# Altium schematic sheet Buck.SchDoc
size A4; SheetNumber: 2; SheetTotal: 6
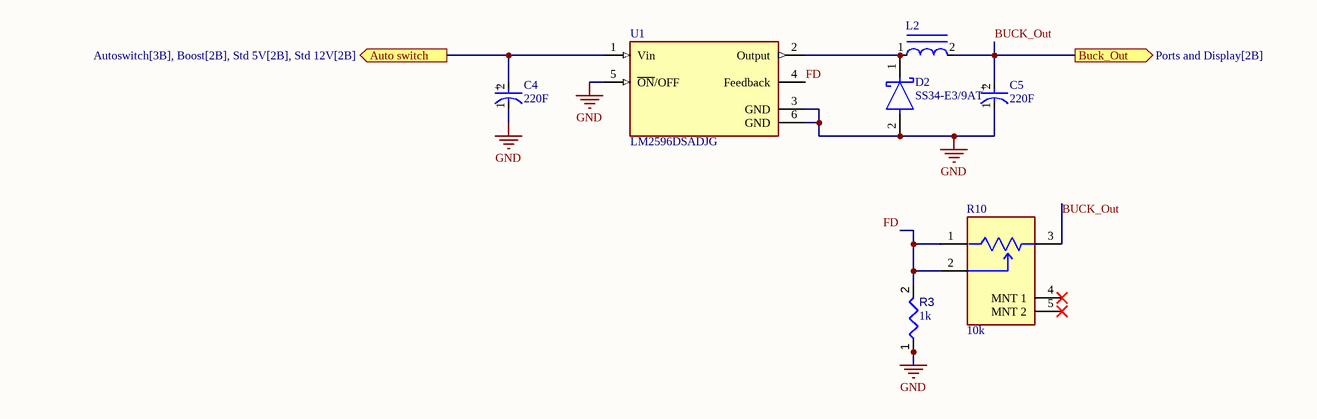
[diagram p0: Buck.SchDoc]

## Parts
C4  value 220F  [FP-FTF-MFG]  (hidden comment: Capacitors)
C5  value 220F  [FP-FTF-MFG]  (hidden comment: Capacitors)
D2  SS34-E3/9AT  [FP-SMC-MFG]
L2  DR127-330-R  [FP-DR127-MFG]  (value not drawn)
R3  value 1k  [RESC0805(2012)_L]  (hidden comment: 1KR5J)
R10  value 10k  [FP-PTV09A-4-MFG]  (hidden comment: PTV09A-4225F-B103)
U1  LM2596DSADJG  [FP-936A-02-MFG]

## Ports
Auto switch (out, see Autoswitch[3B], Boost[2B], Std 5V[2B], Std 12V[2B]), Buck_Out (out, see Ports and Display[2B])

## Nets
GND: C4.1(C) C5.1(C) D2.2(A) R3.1 U1.3(GND) U1.5(~{ON}/OFF) U1.6(GND)
Auto switch: C4.2(A) U1.1(Vin) ; port Auto switch
BUCK_Out: C5.2(A) L2.2 R10.3 ; port Buck_Out
FD: R3.2 R10.1 R10.2 U1.4(Feedback)
NetD2_1: D2.1(C) L2.1 U1.2(Output)

Not connected (* = marked no-connect by the designer): R10 4(MNT_1)* 5(MNT_2)*

## Notes on the sheet
- (in symbol CMP-001-00083-1) +

## Library data of the parts
C4 C5 = CMP-001-00083-1: Aluminum Electrolytic Capacitor, Polarized, Aluminum (wet), 50V, 20% +Tol, 20% -Tol, 220uF, Surface Mount, 3333; Dielectric Material: Aluminium; Ripple Current: 435.5mA; Tan Delta: 0.1; ESR (Equivalent Series Resistance): 180mR; Reference Standard: AEC-Q200; Leakage Current: 110uA; RoHS Compliant: Yes; Tolerance (fill in as +-): 20%; Length: 10.2mm; Rated DC Voltage (URdc): 50V; Min Operating Temperature: -55°C; Packaging: Tape and Reel; Max Operating Temperature: 105°C; Case/Package: 3333; Tolerance  (fill in as +-): 20%; Capacitor Type: Aluminium; Termination: Flat; Reach SVHC Compliant: Yes; Pins: 2; Polarity: Polarized; Package Style: SMTMeter; Mounting Technology: Surface Mount; Diameter: 8mm
D2 = CMP-004-00032-1: Rectifier Diode, Schottky, 1 Phase, 1 Element, 3A, 40V V(RRM), Silicon, DO-214AB; Max Reverse Current: 500uA; Time @ Peak Reflow Temperature-Max (s): 40s; Case Connection: CATHODE; Qualification Status: Not Qualified; Non-rep Pk Forward Current-Max: 100A; Number of Phases: 1; Package Body Material: Plastic; Application(s): EFFICIENCY; Forward Voltage: 500mV; Diode Type: RECTIFIER; Max Output current: 3A; Peak Reflow Temperature (Cel): 260°C; Package Shape: Rectangular; Terminal Position: DUAL; Terminal Finish: Tin; Min Operating Temperature: -55°C; Max Operating Temperature: 150°C; Diode Element Material: SILICON; Package Style: SMALL OUTLINEMeter; Technology: SCHOTTKY; Number of Elements: 1; Moisture Sensitivity Level: 1; Surface Mount: Yes; JESD-30 Code: R-PDSO-C2; RoHS Compliant: Yes; Rep Pk Reverse Voltage-Max: 40V; Terminal Form: C BEND; Pins: 2; JESD-609 Code: e3; JEDEC-95 Code: DO-214AB; Reach SVHC Compliant: No
L2 = CMP-006-00021-1: General Purpose Inductor, 33uH, 20%, 1 Element, Ferrite-Core, SMD, 4949; Package Width: 12.5mm; Case/Size Code: 4949; Shape/Size Description: RECTANGULAR PACKAGE; Inductor Application: DC-DC CONVERTER; Channels: 1; Test Frequency: 100kHz; Package Height: 8mm; Shielding: Shielded; Max Current Rating: 3.23A; DC Resistance (DCR): 60mR; Reach SVHC Compliant: Yes; Surface Mount: Yes; Max Operating Temperature: 125°C; Terminal Placement: Dual Ended; JESD-609 Code: e3; Package Style: SMTMeter; Inductance-Nom (L): 33uH; Package Length: 12.5mm; Tolerance: 20%; RoHS Compliant: Yes; Termination: One Surface; Inductor Type: GENERAL PURPOSE INDUCTOR; Pins: 2; Core Material: Ferrite; Terminal Finish: Nickel; Min Operating Temperature: -40°C; Packaging: Tape and Reel; Construction: Magnetic Shielded
R3 = CMP-009-00076-2: 1K 0.125W 5% 0805 (2012 Metric)  SMD; Power: 125mW; Pins: 2; Mounting Technology: SMT; Tolerance: 5%; Case/Package: 0805
R10 = CMP-009-00177-1: Potentiometer, Carbon, 0.05W, 10000ohm, 20V, 20% +/-Tol, 3943; Package Length: 9.8mm; Rotational Angle: 280°; Package Width: 11mm; Package Height: 6.8mm; Power: 50mW; Min Operating Temperature: -10°C; JESD-609 Code: e3; Max Operating Temperature: 50°C; Tolerance: 20%; Terminal Finish: Copper; Construction: SQUARE; Case/Package: 3943; Reach SVHC Compliant: Yes; Working Voltage: 20V; RoHS Compliant: Yes; Technology: CARBON; Resistor Type: Potentiometer
U1 = CMP-019-00050-1: Switching Regulator, Voltage-mode, 7.5A, 180kHz Switching Freq-Max, PSSO5; Nominal Output Voltage: 5V; Qualification Status: Not Qualified; Switcher Configuration: BUCK; Min Input Voltage: 4.5V; Package Equivalence Code: SMSIP5H,.6,67TB; Package Body Material: Plastic; Channels: 1; Max Supply Voltage: 40V; Nominal Supply Voltage: 12V; Min Operating Temperature: -40°C; Package Shape: Rectangular; Terminal Finish: Tin; Moisture Sensitivity Level: 1; JESD-30 Code: R-PSSO-G5; Max Operating Temperature: 125°C; Terminal Form: Gull Wing; Temperature Grade: AUTOMOTIVE; Reach SVHC Compliant: No; JESD-609 Code: e3; Control Mode: VOLTAGE-MODE; Terminal Position: SINGLE; Package Style: SMALL OUTLINEMeter; Throw Configuration: SWITCHING REGULATOR; Terminal Pitch: 1.702mm; Surface Mount: Yes; Width: 9.1945mm; RoHS Compliant: Yes; Max Output current: 7.5A; Length: 10.02mm; Pins: 5; Frequency: 180kHz; Case/Package: HSOP